# Altium schematic sheet BusDup.SchDoc
size Letter; Author: Adam Gilbert; CompanyName: McGill University; DrawnBy: Adam Gilbert; Organization: Altium Limited; Address1: McGill Cosmology; Address2: 3600 University Street; Address3: Montreal, Quebec; Address4: Canada; DocumentNumber: 14; Revision: Rev2; SheetNumber: 14; SheetTotal: 16; ProjectTitle: DfMux FMC Mezz; ModelNumber: MGMEZZ04; ProjectName: DfMux FMC Mezz
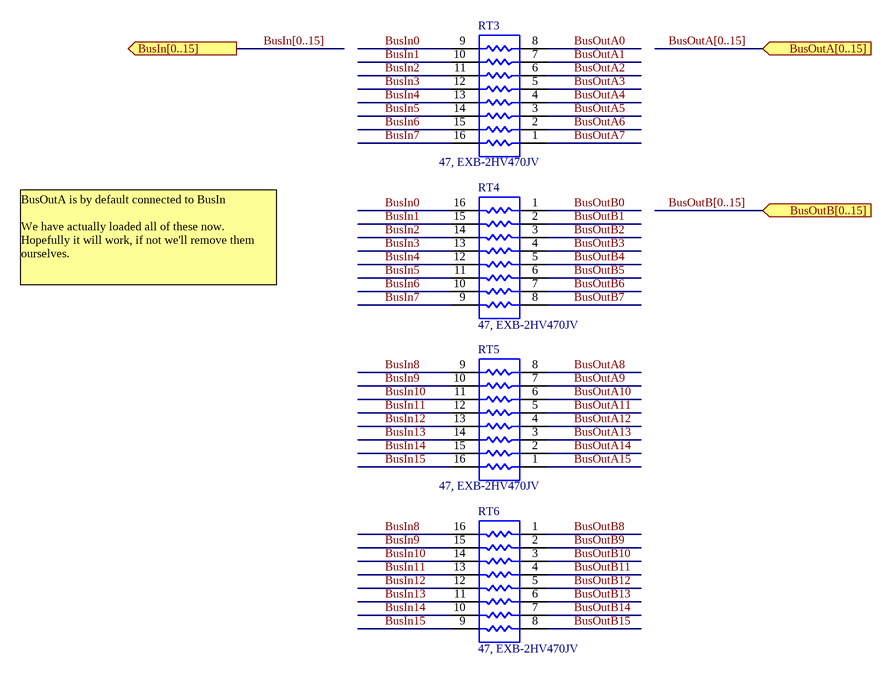
[diagram p0: BusDup.SchDoc]

## Parts
RT3  47, EXB-2HV470JV  [0402_Array_2HV]
RT4  47, EXB-2HV470JV  [0402_Array_2HV]
RT5  47, EXB-2HV470JV  [0402_Array_2HV]
RT6  47, EXB-2HV470JV  [0402_Array_2HV]

## Ports
BusIn[0..15] (out), BusOutA[0..15] (in), BusOutB[0..15] (in)

## Nets
BusIn0: RT3.9 RT4.16
BusIn1: RT3.10 RT4.15
BusIn2: RT3.11 RT4.14
BusIn3: RT3.12 RT4.13
BusIn4: RT3.13 RT4.12
BusIn5: RT3.14 RT4.11
BusIn6: RT3.15 RT4.10
BusIn7: RT3.16 RT4.9
BusIn8: RT5.9 RT6.16
BusIn9: RT5.10 RT6.15
BusIn10: RT5.11 RT6.14
BusIn11: RT5.12 RT6.13
BusIn12: RT5.13 RT6.12
BusIn13: RT5.14 RT6.11
BusIn14: RT5.15 RT6.10
BusIn15: RT5.16 RT6.9
BusOutA0: RT3.8
BusOutA1: RT3.7
BusOutA2: RT3.6
BusOutA3: RT3.5
BusOutA4: RT3.4
BusOutA5: RT3.3
BusOutA6: RT3.2
BusOutA7: RT3.1
BusOutA8: RT5.8
BusOutA9: RT5.7
BusOutA10: RT5.6
BusOutA11: RT5.5
BusOutA12: RT5.4
BusOutA13: RT5.3
BusOutA14: RT5.2
BusOutA15: RT5.1
BusOutB0: RT4.1
BusOutB1: RT4.2
BusOutB2: RT4.3
BusOutB3: RT4.4
BusOutB4: RT4.5
BusOutB5: RT4.6
BusOutB6: RT4.7
BusOutB7: RT4.8
BusOutB8: RT6.1
BusOutB9: RT6.2
BusOutB10: RT6.3
BusOutB11: RT6.4
BusOutB12: RT6.5
BusOutB13: RT6.6
BusOutB14: RT6.7
BusOutB15: RT6.8

## Buses and harness runs
bus BusIn[0..15] = port BusIn[0..15]
bus BusOutA[0..15] = port BusOutA[0..15]
bus BusOutB[0..15] = port BusOutB[0..15]

## Notes on the sheet
- BusOutA is by default connected to BusIn
  We have actually loaded all of these now. Hopefully it will work, if not we'll remove them ourselves.
- File:
- Size:
- Date:
- Letter
- Revision:
- Sheet
- of
- Cosmology
- Drawn by:

## Library data of the parts
RT3-RT6 = Res_Pack: RES ARRAY 47 OHM SMD; Manufacturer: Panasonic - ECG; Assembly Comments: none; Part constraints: EXB-2HV470JV; Manufacturer Part Number 1: EXB-2HV470JV; Supplier 1: Digikey; Supplier Part Number 1: Y1470CT-ND